# Altium project Battery Chager x3.PrjPcb
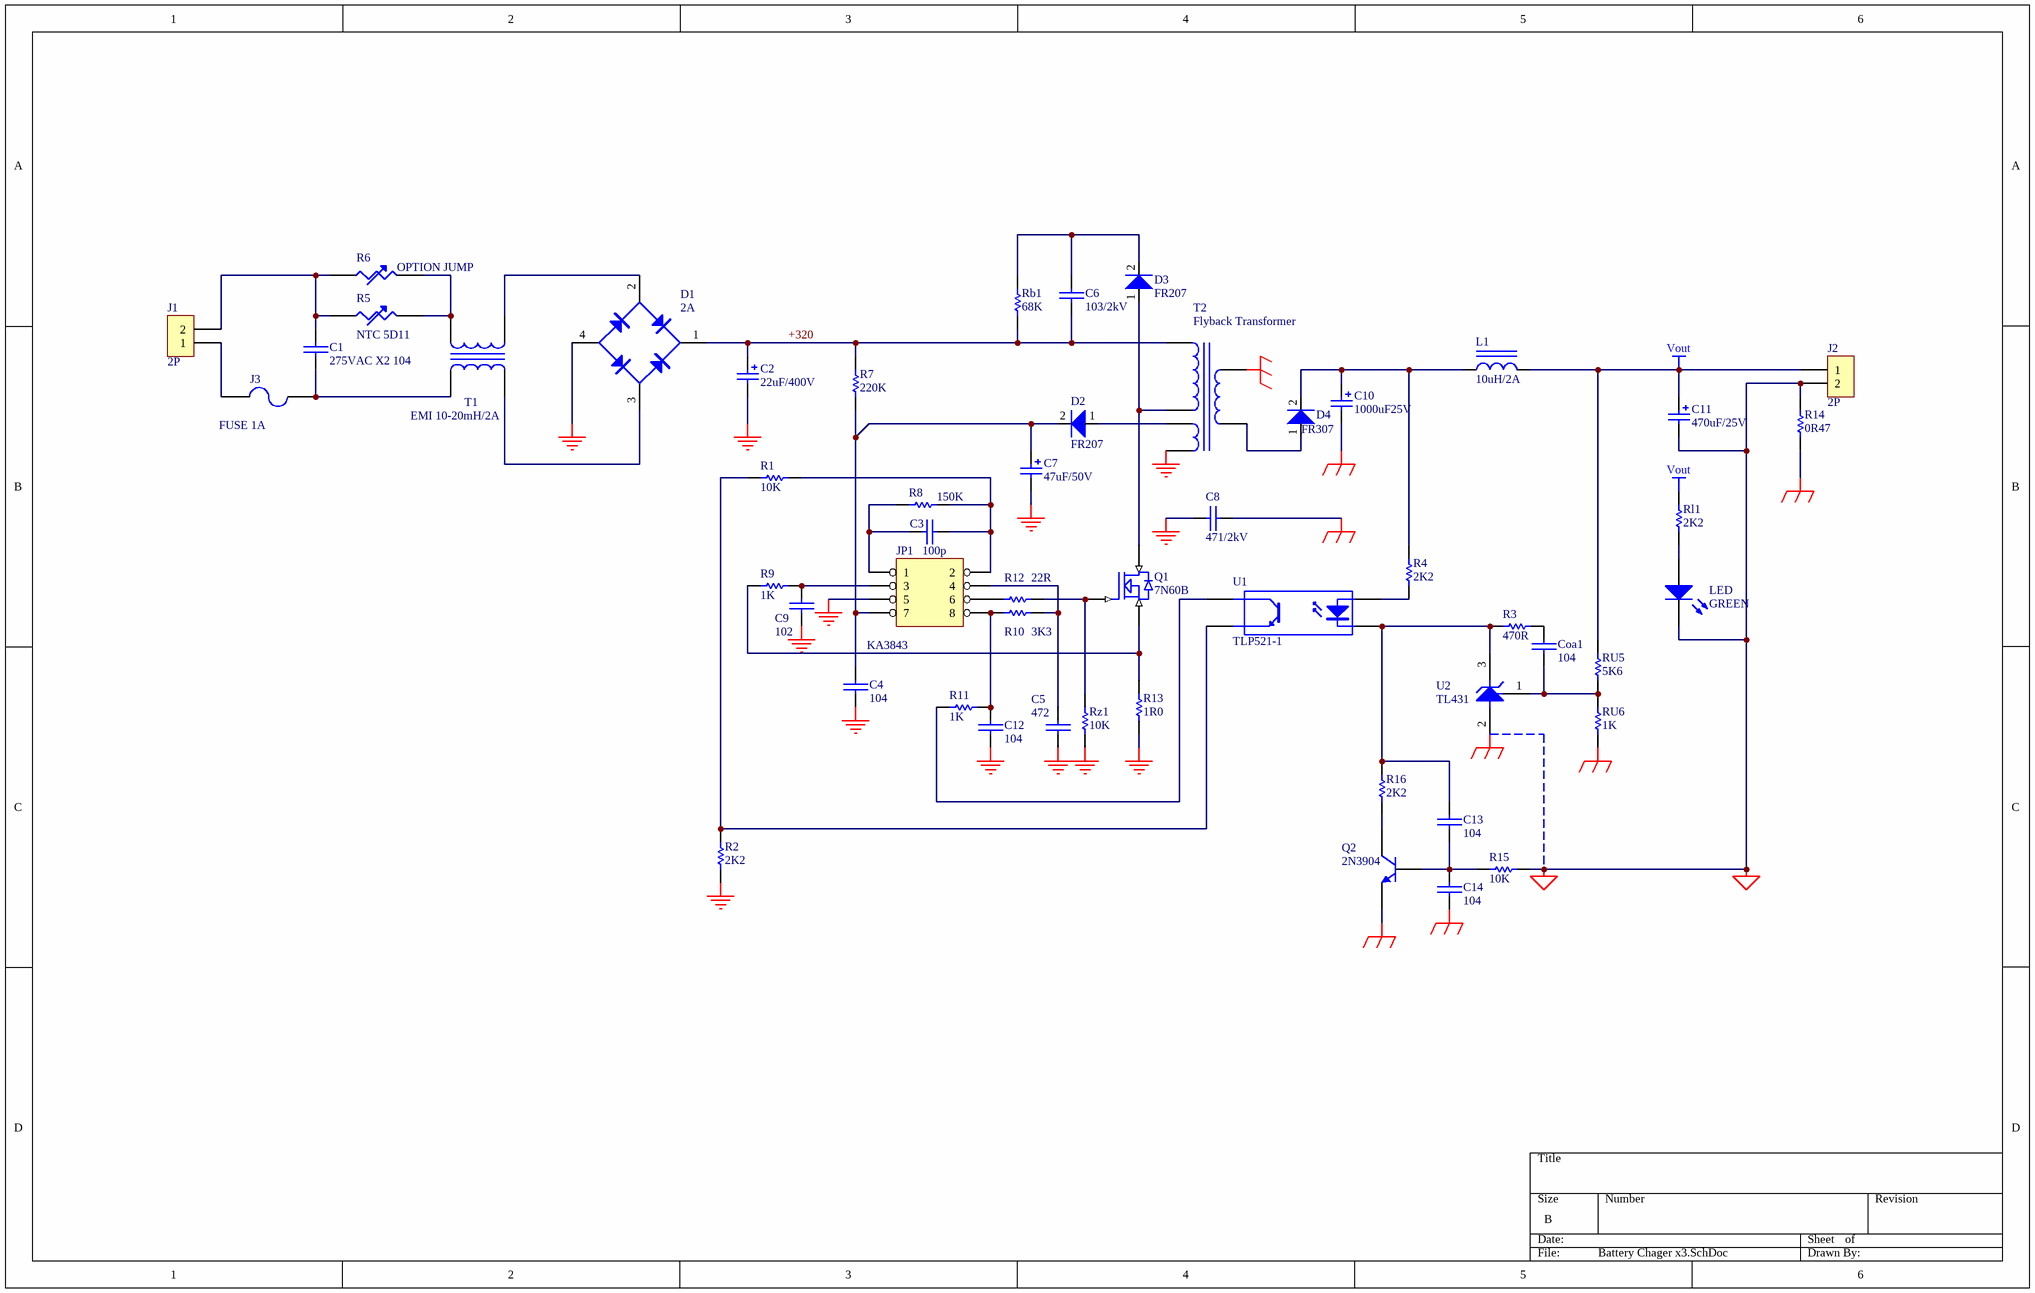
[diagram p0: Battery Chager x3.SchDoc]
1 sheet, 52 parts. Net scope: global (net labels, ports and power ports of the same name join across sheets).

## Sheet Battery Chager x3.SchDoc
size B

### Parts
C1  value 275VAC X2 104  [100N400v]
C2  value 22uF/400V  [1000u50v]
C3  value 100p  [0805C]
C4  value 104  [0805C]
C5  value 472  [104nho]
C6  value 103/2kV  [10n1000v]
C7  value 47uF/50V  [10u50V]
C8  value 471/2kV  [10n1000v]
C9  value 102  [0805C]
C10  value 1000uF25V  [1000u16v]
C11  value 470uF/25V  [1000u16v]
C12  value 104  [0805C]
C13  value 104  [0805C]
C14  value 104  [0805C]
Coa1  value 104  [0805C]
D1  value 2A  [Cau2a]
D2  value FR207  [DIODE1A]
D3  value FR207  [DIODE1A]
D4  value FR307  [1N5408]
J1  value 2P  [jack2_nam]
J2  value 2P  [jack2_nam]
J3  value FUSE 1A  [R2W_DUNG]  (hidden comment: Cầu chì 1A/275V)
JP1  value KA3843  [DIP8]  (hidden comment: IC điều khiển nguồn AC-DC KA3843)
L1  value 10uH/2A  [330uH]
LED  value GREEN  [LED0805]
Q1  value 7N60B  [TO220TNB]
Q2  value 2N3904  [SOT23S]
R1  value 10K  [0805DD]
R2  value 2K2  [0805DD]
R3  value 470R  [0805DD]
R4  value 2K2  [0805DD]
R5  value NTC 5D11  [CSIP4]  (hidden comment: Nhiệt điện trở âm NTC 5D11)
R6  OPTION JUMP  [XPAD]
R7  value 220K  [R2W_DUNG]
R8  value 150K  [0805DD]
R9  value 1K  [0805DD]
R10  value 3K3  [0805DD]
R11  value 1K  [0805DD]
R12  value 22R  [0805DD]
R13  value 1R0  [R2WDUNG]
R14  value 0R47  [R2WDUNG]
R15  value 10K  [0805DD]
R16  value 2K2  [0805DD]
Rb1  value 68K  [AXIAL0.4]
Rl1  value 2K2  [0805DD]
RU5  value 5K6  [0805DD]
RU6  value 1K  [0805DD]
Rz1  value 10K  [0805DD]
T1  value EMI 10-20mH/2A  [EMI_Filter]  (hidden comment: Cuộn cảm lọc đầu vào EMI Filter 10-20mH/2A)
T2  value Flyback Transformer  [Trans6c]  (hidden comment: Biến áp xung Flyback)
U1  value TLP521-1  [TLP521_1]
U2  value TL431  [TO92_431]

### Nets
EARTH: C8.2 C10.2 C14.2 Q2.3(E) R14.1 RU6.2 T2.5 U2.2(A)
EARTH2: C11.2 J2.2 LED.2(K) R14.2 R15.2
GND: C2.2 C4.2 C5.1 C7.2 C8.1 C9.2 C12.2 D1.4(V-) JP1.5 R2.2 R13.2 Rz1.2 T2.4
Vout: C11.1 J2.1 L1.2 Rl1.1 RU5.1
+320: C2.1 C6.2 D1.1(V+) R7.2 Rb1.2 T2.1
NetC1_1: C1.1 J3.2 T1.1
NetC1_2: C1.2 J1.2 R5.1 R6.1
NetC3_1: C3.1 JP1.1 R8.1
NetC3_2: C3.2 JP1.2 R1.2 R8.2
NetC4_1: C4.1 C7.1 D2.2(K) JP1.7 R7.1
NetC5_2: C5.2 JP1.4 R10.2
NetC6_1: C6.1 D3.2(K) Rb1.1
NetC9_1: C9.1 JP1.3 R9.1
NetC10_1: C10.1 D4.2(K) L1.1 R4.2
NetC12_1: C12.1 JP1.8 R10.1 R11.1
NetC13_1: C13.1 C14.1 Q2.1(B) R15.1
NetC13_2: C13.2 R3.2 R16.2 U1.2(K) U2.3(K)
NetCoa1_1: Coa1.1 R3.1
NetCoa1_2: Coa1.2 RU5.2 RU6.1 U2.1(R)
NetD1_2: D1.2(AC) T1.4
NetD1_3: D1.3(AC) T1.3
NetD2_1: D2.1(A) T2.3
NetD3_1: D3.1(A) Q1.2(D) T2.2
NetD4_1: D4.1(A) T2.6
NetJ1_1: J1.1 J3.1
NetJP1_6: JP1.6 R12.1
NetLED_1: LED.1(A) Rl1.2
NetQ1_1: Q1.1(G) R12.2 Rz1.1
NetQ1_3: Q1.3(S) R9.2 R13.1
NetQ2_2: Q2.2(C) R16.1
NetR1_1: R1.1 R2.1 U1.3(C)
NetR4_1: R4.1 U1.1(A)
NetR5_2: R5.2 R6.2 T1.2
NetR11_2: R11.2 U1.4(E)

### Library data of the parts
C1 C3-C6 C8 C9 C12-C14 Coa1 = CAP: Type1: Tụ điện dán 0805; Type2: Tụ điện chân cắm
C2 C7 C10 C11 = Cap Pol1: Polarized Capacitor (Radial); Type1: Tụ hóa chân cắm; Type2: Tụ hóa chân dán; Published: *; LatestRevisionDate: *; LatestRevisionNote: *; PackageReference: *; Publisher: *
D1 = BRIDGE1: Diode Bridge; Type1: Cầu chỉnh lưu Diode dẹt, chân cắm
D2 D3 = DIODE: Type1: Diode xung chân cắm 2A; Type2: Diode chỉnh lưu chân cắm 1A; Type3: Diode chỉnh lưu chân cắm 3A
D4 = DIODE: Type1: Diode xung chân cắm 3A; Type2: Diode chỉnh lưu chân cắm 1A; Type3: Diode chỉnh lưu chân cắm 3A
J1 J2 = CON2: Type1: Giắc xanh loại nằm, 300V/16A - 5.08mm; Type2: Jump đực loại thẳng, 2.54mm; Type3: Jumper; Type4: Giắc xanh loại nằm, 300V/16A - 3.81mm
J3 = FUSE2: Fuse
JP1 = HEADER 4X2
L1 = INDUCTORSMALL: Type1: Cuộn cảm chân cắm lõi trụ; Type2: Cuộn cảm chân cắm lõi xuyến
LED = LED0: Typical INFRARED GaAs LED; Type1: LED dán 0805; Type2: LED chân cắm 3mm; Type3: LED chân cắm 5mm; Published: *; LatestRevisionDate: *; LatestRevisionNote: *; PackageReference: *; Publisher: *
Q1 = MOSFET N: Type1: Transistor trường MOSFET N, chân dán TO-263; Type2: Transistor trường MOSFET N, chân cắm TO-220
Q2 = NPN: NPN Bipolar Transistor; Type1: Transistor BJT NPN, chân dán SOT-23; Type2: Transistor BJT NPN, chân cắm TO-92; Published: *; LatestRevisionDate: *; LatestRevisionNote: *; PackageReference: *; Publisher: *; Code_JEDEC: *
R1-R4 R7-R16 Rl1 RU5 RU6 Rz1 = Res Semi: Semiconductor Resistor; Type1: Điện trở dán 0805; Type2: Điện trở chân cắm 1/4W; Type3: Điện trở chân cắm 2W; Type4: Điện trở dán 2512; Published: *; LatestRevisionDate: *; LatestRevisionNote: *; PackageReference: *; Publisher: *
R5 R6 = RES3
Rb1 = Res Semi: Semiconductor Resistor; Type1: Điện trở dán 0805; Type2: Điện trở chân cắm 1/4W; Type3: Điện trở chân cắm 1W; Type4: Điện trở dán 2512; Published: *; LatestRevisionDate: *; LatestRevisionNote: *; PackageReference: *; Publisher: *
T1 = TRANS1
T2 = TRANS6
U1 = OPTOISO1: Optoisolator; Type1: Cách ly quang chân cắm
U2 = TL431: Adjustable Precision Shunt Regulator; Type1: IC điện áp chuẩn, chân cắm TO92